# Altium project RADAR.PrjPcb
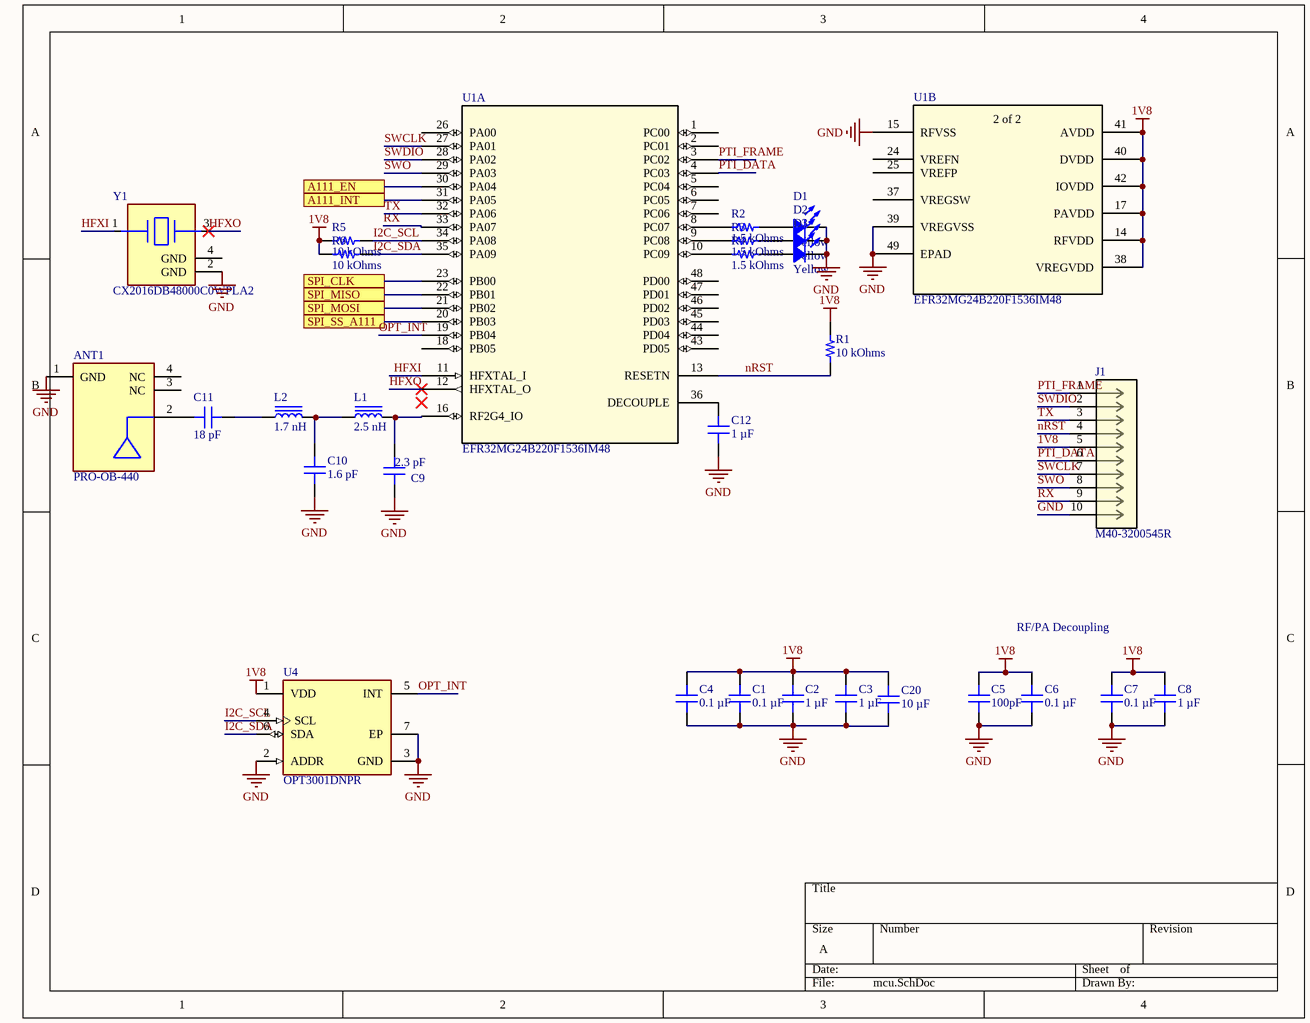
[diagram p0: mcu.SchDoc]
3 sheets, 44 parts. Net scope: flat (ports and power ports of the same name join across sheets).
Board file: PCB.PcbDoc
Sheets:
  mcu.SchDoc
  radar.SchDoc
  power.SchDoc

## Sheet mcu.SchDoc
size A; SheetNumber: 1; SheetTotal: 3

### Parts
(Parts that share a designator on the sheet are numbered #1, #2 ... from top to bottom, then left to right.)
ANT1  PRO-OB-440  [FP-PRO-OB-440-MFG]
C1  0.1 µF  [CAP 0402_1005]
C2  1 µF  [CAP 0402_1005]
C3  1 µF  [CAP 0402_1005]
C4  0.1 µF  [CAP 0402_1005]
C5  100pF  [CAP 0402_1005]
C6  0.1 µF  [CAP 0402_1005]
C7  0.1 µF  [CAP 0402_1005]
C8  1 µF  [CAP 0402_1005]
C9  2.3 pF  [CAP 0402_1005 RF]
C10  1.6 pF  [CAP 0402_1005 RF]
C11  18 pF  [CAP 0402_1005 RF]
C12  1 µF  [CAP 0402_1005]
C20  10 µF  [CAP 0603_1608]
D1  Yellow  [LED 0402_1005 YELLOW]
D2  Yellow  [LED 0402_1005 YELLOW]
D3  Yellow  [LED 0402_1005 YELLOW]
J1  M40-3200545R  [CONN10_M40-3200545R_HRW]
L1  2.5 nH  [IND 0402_1005 RF WW]
L2  1.7 nH  [IND 0402_1005 RF WW]
R1  10 kOhms  [RES 0402_1005]
R2  1.5 kOhms  [RES 0402_1005]
R3  1.5 kOhms  [RES 0402_1005]
R4  1.5 kOhms  [RES 0402_1005]
R5  10 kOhms  [RES 0402_1005]
R6  10 kOhms  [RES 0402_1005]
U1  EFR32MG24B220F1536IM48  [QFN48_0p4_6sq_SIL]  (parts A,B of 2)
U4#1  OPT3001DNPR  [FP-DNP0006A-MFG]
Y1  CX2016DB48000C0WPLA2  [FP-CX2016DB48000C0WPLA2-MFG]

### Ports
A111_EN, A111_INT, SPI_CLK, SPI_MISO, SPI_MOSI, SPI_SS_A111

### Nets
1V8: C1.2 C2.2 C3.2 C4.2 C5.2 C6.2 C7.2 C8.2 C20.2 J1.5 R1.1 R5.2 R6.2 U1.14(RFVDD) U1.17(PAVDD) U1.38(VREGVDD) U1.40(DVDD) U1.41(AVDD) U1.42(IOVDD) U4#1.1(VDD)
GND: ANT1.1(GND) C1.1 C2.1 C3.1 C4.1 C5.1 C6.1 C7.1 C8.1 C9.1 C10.1 C12.1 C20.1 D1.2 D2.2 D3.2 J1.10 U1.15(RFVSS) U1.39(VREGVSS) U1.49(EPAD) U4#1.2(ADDR) U4#1.3(GND) U4#1.7(EP) Y1.2(GND)
HFXI: U1.11(HFXTAL_I) Y1.1(1_HOT)
HFXO: U1.12(HFXTAL_O) Y1.3(2_HOT)
I2C_SCL: R5.1 U1.34(PA08) U4#1.4(SCL)
I2C_SDA: R6.1 U1.35(PA09) U4#1.6(SDA)
nRST: J1.4 R1.2 U1.13(RESETN)
OPT_INT: U1.19(PB04) U4#1.5(INT)
PTI_DATA: J1.6 U1.4(PC03)
PTI_FRAME: J1.1 U1.3(PC02)
RX: J1.9 U1.33(PA07)
SWCLK: J1.7 U1.27(PA01)
SWDIO: J1.2 U1.28(PA02)
SWO: J1.8 U1.29(PA03)
TX: J1.3 U1.32(PA06)
NetANT1_2: ANT1.2(RF_FEED) C11.1
NetC9_2: C9.2 L1.2 U1.16(RF2G4_IO)
NetC10_2: C10.2 L1.1 L2.2
NetC11_2: C11.2 L2.1
NetC12_2: C12.2 U1.36(DECOUPLE)
NetD1_1: D1.1 R2.1
NetD2_1: D2.1 R3.1
NetD3_1: D3.1 R4.1
NetR2_2: R2.2 U1.8(PC07)
NetR3_2: R3.2 U1.9(PC08)
NetR4_2: R4.2 U1.10(PC09)
NetU1_20: U1.20(PB03) ; port SPI_SS_A111
NetU1_21: U1.21(PB02) ; port SPI_MOSI
NetU1_22: U1.22(PB01) ; port SPI_MISO
NetU1_23: U1.23(PB00) ; port SPI_CLK
NetU1_30: U1.30(PA04) ; port A111_EN
NetU1_31: U1.31(PA05) ; port A111_INT

Not connected (* = marked no-connect by the designer): ANT1 3(NC) 4(NC); U1 1(PC00) 2(PC01) 5(PC04) 6(PC05) 7(PC06) 18(PB05) 24(VREFN) 25(VREFP) 26(PA00) 37(VREGSW) 43(PD05) 44(PD04) 45(PD03) 46(PD02) 47(PD01) 48(PD00); Y1 4(GND)

### Notes on the sheet
- RF/PA Decoupling
- (in symbol EFR32MG24B220F1536IM48, part B) 2 of 2

### Library data of the parts
ANT1 = CMP-231248-000001-1: RF ANT 2.4GHZ STAMPED MET SLD; Manufacturer: ProAnt; Return Loss: -10dB; Impedance: 50Ω; Max Frequency: 2500MHz; Number Of Bands: 1; Bandwidth: 2400-2500MHz; Temperature Range Low: -40°C; Height: 3.53mm; ComponentLink2URL: http://www.proant.se/files/user/Documents/Datasheets%20and%20appnotes/Upload%202018-06-08/Application%20note%20-%20OnBoard%20SMD%202400%20MHz%20rev%203.2.pdf; Octopart: https://octopart.com/pro-ob-440-proant+ab-62921801; Digikey Description: RF ANT 2.4GHZ STAMPED MET SLD; Device Class L1: Integrated Circuits (ICs); ComponentLink2Description: Datasheet; Package: PRO-OB-440; Temperature: -40°C to +125°C; Category: Ant; Lead Free: Yes; Device Class L3: RF Antennas; RoHS: TRUE; Automotive: No; Device Class L2: RF Semiconductors and Devices; Manufacturer Part Number: PRO-OB-440; Temperature Range High: +125°C
C1 = C0402C104K4RECAUTO: CAP CER 0402 0.1UF 16V X7R 10%; manufacturer: KEMET; Part Number: C0402C104K4RECAUTO; Value: 0.1 µF; Applications: Automotive, ESD Protection; Capacitance: 0.1 µF; componentlink1description: Datasheet; componentlink1url: https://api.kemet.com/component-edge/download/datasheet/C0402C104K4RECAUTO.pdf; componentlink2description: DigiKey Link; componentlink2url: https://www.digikey.com/en/products/detail/kemet/C0402C104K4RECAUTO/8563695; Device Package: 0402 (1005 Metric); lastupdated: 1/9/2022 12:30:53 pm; Lifecycle Status: Active; Minimum Order: 1; Mounting Type: Surface Mount, MLCC; Operating Temperature: -55°C ~ 125°C; Package / Case: 0402 (1005 Metric); packaging: TapeAndReel; partid: 1731; Part Status: Active; price: 0.01; Ratings: AEC-Q200; series: ESD SMD Auto X7R; Size / Dimension: 0.039" L x 0.020" W (1.00mm x 0.50mm); Supplier 1: DigiKey; Supplier Part Number 1: 399-17167-1-ND; Temperature Coefficient: X7R; Thickness (Max): 0.022" (0.55mm); Tolerance: ±10%; Voltage - Rated: 16V
C2 C3 = LMK105BJ105MVHF: CAP CER 1UF 10V X5R 0402; manufacturer: Taiyo Yuden; Tolerance: ±20%; Part Number: LMK105BJ105MVHF; Value: 1 µF; Applications: Automotive, SMPS Filtering; Capacitance: 1 µF; componentlink1description: Datasheet; componentlink1url: https://ds.yuden.co.jp/TYCOMPAS/ut/detail?pn=LMK105BJ105MVHF &u=M; componentlink2description: DigiKey Link; componentlink2url: https://www.digikey.com/en/products/detail/taiyo-yuden/LMK105BJ105MVHF/7403746; Device Package: 0402 (1005 Metric); lastupdated: 1/9/2022 12:30:35 pm; Lifecycle Status: Active; Minimum Order: 1; Mounting Type: Surface Mount, MLCC; Operating Temperature: -55°C ~ 85°C; Package / Case: 0402 (1005 Metric); packaging: TapeAndReel; partid: 46675; Part Status: Active; price: 0.01; Ratings: AEC-Q200; series: M; Size / Dimension: 0.039" L x 0.020" W (1.00mm x 0.50mm); Supplier 1: DigiKey; Supplier Part Number 1: 587-6276-1-ND; Temperature Coefficient: X5R; Thickness (Max): 0.022" (0.55mm); Voltage - Rated: 10V
C4 C6 C7 C12 = C0402C104K7PAC7867: CAP CER 0.1UF 4V X5R 0402; manufacturer: KEMET; Tolerance: ±10%; Part Number: C0402C104K7PAC7867; Applications: Bypass, Decoupling; componentlink1description: Datasheet; componentlink1url: https://api.kemet.com/component-edge/download/datasheet/C0402C104K7PAC7867.pdf; componentlink2description: DigiKey Link; componentlink2url: https://www.digikey.com/en/products/detail/kemet/C0402C104K7PAC7867/7381987; Device Package: 0402 (1005 Metric); lastupdated: 1/9/2022 12:30:40 pm; Lifecycle Status: Active; Minimum Order: 1; Mounting Type: Surface Mount, MLCC; Operating Temperature: -55°C ~ 85°C; Package / Case: 0402 (1005 Metric); packaging: TapeAndReel; partid: 5603; Part Status: Active; price: 0.01; series: SMD Comm X5R; Size / Dimension: 0.039" L x 0.020" W (1.00mm x 0.50mm); Supplier 1: DigiKey; Supplier Part Number 1: 399-14871-1-ND; Temperature Coefficient: X5R; Thickness (Max): 0.022" (0.55mm); Voltage - Rated: 4V
  C4 C6 C7: Value: 0.1 µF; Capacitance: 0.1 µF
  C12: Value: 1 µF; Capacitance: 1 µF
C5 = 04026C101KAT2A: CAP CER 100PF 6.3V X7R 0402; manufacturer: AVX Corporation; Tolerance: ±10%; Part Number: 04026C101KAT2A; Value: 100pF; Applications: General Purpose; Capacitance: 100pF; componentlink1description: Datasheet; componentlink1url: http://datasheets.avx.com/X7RDielectric.pdf; componentlink2description: DigiKey Link; componentlink2url: http://digikey.com/product-detail/en/avx-corporation/04026C101KAT2A/478-12647-1-ND/9949180; Device Package: 0402 (1005 Metric); lastupdated: 8/2/2022 12:26:54 pm; Lifecycle Status: Active; Minimum Order: 1; Mounting Type: Surface Mount, MLCC; Operating Temperature: -55°C ~ 125°C; Package / Case: 0402 (1005 Metric); packaging: TapeAndReel; partid: 4266; Part Status: Active; price: 0.04; series: -; Size / Dimension: 0.039" L x 0.020" W (1.00mm x 0.50mm); Supplier 1: DigiKey; Supplier Part Number 1: 478-12647-1-ND; Temperature Coefficient: X7R; Thickness (Max): 0.022" (0.56mm); Voltage - Rated: 6.3V
C8 = CGB2T1X5R0G105M022BC: CAP CER 1UF 4V X5R 0402; manufacturer: TDK Corporation; Tolerance: ±20%; Part Number: CGB2T1X5R0G105M022BC; Value: 1 µF; Applications: General Purpose; Capacitance: 1 µF; componentlink1description: Datasheet; componentlink1url: https://product.tdk.com/info/en/catalog/datasheets/mlcc_commercial_lowprofile_en.pdf?ref_disty=digikey; componentlink2description: DigiKey Link; componentlink2url: https://www.digikey.com/en/products/detail/tdk-corporation/CGB2T1X5R0G105M022BC/4278344; Device Package: 0402 (1005 Metric); Features: Low Profile; lastupdated: 1/9/2022 12:30:48 pm; Lifecycle Status: Active; Minimum Order: 1; Mounting Type: Surface Mount, MLCC; Operating Temperature: -55°C ~ 85°C; Package / Case: 0402 (1005 Metric); packaging: TapeAndReel; partid: 2563; Part Status: Active; price: 0.08; series: CGB; Size / Dimension: 0.039" L x 0.020" W (1.00mm x 0.50mm); Supplier 1: DigiKey; Supplier Part Number 1: 445-15611-1-ND; Temperature Coefficient: X5R; Thickness (Max): 0.009" (0.22mm); Voltage - Rated: 4V
C9 = GJM1555C1H2R3BB01D: CAP CER 2.3PF 50V C0G/NP0 0402; manufacturer: Murata Electronics; Temperature Coefficient: C0G, NP0; Tolerance: ±0.1pF; Part Number: GJM1555C1H2R3BB01D; Applications: RF, Microwave, High Frequency; Capacitance: 2.3 pF; componentlink1description: Datasheet; componentlink1url: https://search.murata.co.jp/Ceramy/image/img/A01X/G101/ENG/GJM1555C1H2R3BB01-01.pdf; componentlink2description: DigiKey Link; componentlink2url: https://www.digikey.com/en/products/detail/murata-electronics/GJM1555C1H2R3BB01D/2592923; Device Package: 0402 (1005 Metric); Features: High Q, Low Loss; lastupdated: 1/9/2022 1:07:39 pm; Lifecycle Status: Active; Minimum Order: 1; Mounting Type: Surface Mount, MLCC; Operating Temperature: -55°C ~ 125°C; Package / Case: 0402 (1005 Metric); packaging: TapeAndReel; partid: 2854; Part Status: Active; price: 0.02; series: GJM; Size / Dimension: 0.039" L x 0.020" W (1.00mm x 0.50mm); Supplier 1: DigiKey; Supplier Part Number 1: 490-GJM1555C1H2R3BB01DCT-ND; Thickness (Max): 0.022" (0.55mm); value: 2.3 pF; Voltage - Rated: 50V
C10 = GJM1555C1H1R6CB01D: CAP CER 1.6PF 50V C0G/NP0 0402; manufacturer: Murata Electronics; Temperature Coefficient: C0G, NP0; Tolerance: ±0.25pF; Part Number: GJM1555C1H1R6CB01D; Applications: RF, Microwave, High Frequency; Capacitance: 1.6 pF; componentlink1description: Datasheet; componentlink1url: https://search.murata.co.jp/Ceramy/image/img/A01X/G101/ENG/GJM1555C1H1R6CB01-01.pdf; componentlink2description: DigiKey Link; componentlink2url: https://www.digikey.com/en/products/detail/murata-electronics/GJM1555C1H1R6CB01D/702281; Device Package: 0402 (1005 Metric); Features: High Q, Low Loss; lastupdated: 1/9/2022 1:07:42 pm; Lifecycle Status: Active; Minimum Order: 1; Mounting Type: Surface Mount, MLCC; Operating Temperature: -55°C ~ 125°C; Package / Case: 0402 (1005 Metric); packaging: TapeAndReel; partid: 624; Part Status: Active; price: 0.01; series: GJM; Size / Dimension: 0.039" L x 0.020" W (1.00mm x 0.50mm); Supplier 1: DigiKey; Supplier Part Number 1: 490-3088-1-ND; Thickness (Max): 0.022" (0.55mm); value: 1.6 pF; Voltage - Rated: 50V
C11 = 600L180FW200T: CAP CER 18PF 200V NP0 0402; manufacturer: American Technical Ceramics; Temperature Coefficient: C0G, NP0; Tolerance: ±1%; Part Number: 600L180FW200T; Applications: RF, Microwave, High Frequency, Bypass, Decoupling; Capacitance: 18 pF; componentlink1description: Datasheet; componentlink1url: http://www.atceramics.com/UserFiles/600l.pdf; componentlink2description: DigiKey Link; componentlink2url: https://www.digikey.com/en/products/detail/american-technical-ceramics/600L180FW200T/3908918; Device Package: 0402 (1005 Metric); Features: High Q, Low Loss, Ultra Low ESR; lastupdated: 1/9/2022 1:07:41 pm; Lifecycle Status: Active; Minimum Order: 1; Mounting Type: Surface Mount, MLCC; Operating Temperature: -55°C ~ 125°C; Package / Case: 0402 (1005 Metric); packaging: TapeAndReel; partid: 1343; Part Status: Active; price: 0.49; series: ATC 600L; Size / Dimension: 0.040" L x 0.020" W (1.02mm x 0.51mm); Supplier 1: DigiKey; Supplier Part Number 1: 478-12298-1-ND; Thickness (Max): 0.024" (0.60mm); value: 18 pF; Voltage - Rated: 200V
C20 = GRM188R60J106ME47D: CAP CER 10UF 6.3V X5R 0603; manufacturer: Murata Electronics; Tolerance: ±20%; Part Number: GRM188R60J106ME47D; Value: 10 µF; Applications: General Purpose; Capacitance: 10 µF; componentlink1description: Datasheet; componentlink1url: https://www.murata.com/~/media/webrenewal/support/library/catalog/products/capacitor/mlcc/c02e.ashx?la=en-us; componentlink2description: DigiKey Link; componentlink2url: https://www.digikey.com/en/products/detail/murata-electronics/GRM188R60J106ME47D/965910; Device Package: 0603 (1608 Metric); lastupdated: 11/9/2022 9:40:24 am; Lifecycle Status: Active; Minimum Order: 1; Mounting Type: Surface Mount, MLCC; Operating Temperature: -55°C ~ 85°C; Package / Case: 0603 (1608 Metric); packaging: TapeAndReel; partid: 2351; Part Status: Active; price: 0.02; series: GRM; Size / Dimension: 0.063" L x 0.031" W (1.60mm x 0.80mm); Supplier 1: DigiKey; Supplier Part Number 1: 490-3896-1-ND; Temperature Coefficient: X5R; Thickness (Max): 0.035" (0.90mm); Voltage - Rated: 6.3V
D1-D3 = BL-HKC37A-AV-TRB: 0402 YELLOW; Manufacturer: American Bright Optoelectronics Corporation; Configuration: Standard; Current - Test: 20mA; Lens Color: Colorless; Lens Style: Rectangle with Flat Top; Lens Transparency: Clear; Millicandela Rating: 120mcd; Viewing Angle: 120°; Voltage - Forward (Vf) (Typ): 2.2V; Wavelength - Dominant: 589nm; Wavelength - Peak: 590nm; Part Number: BL-HKC37A-AV-TRB; Color: Yellow; ComponentLink1Description: Datasheet; ComponentLink1URL: https://americanbrightled.com/pdffiles/smt/BL-HKC37A-AV-TRB.pdf; ComponentLink2Description: DigiKey Link; ComponentLink2URL: https://www.digikey.com/en/products/detail/american-bright-optoelectronics-corporation/BL-HKC37A-AV-TRB/9678171; Device Package: 0402 (1005 Metric); Height (Max): 0.45mm; LastUpdated: 11/9/2022 10:29:51 am; Lifecycle Status: Active; Minimum Order: 1; Mounting Type: Surface Mount; Package / Case: 0402 (1005 Metric); Packaging: TapeAndReel; PartId: 1041; Part Status: Active; Price: 0.06; Series: -; Size / Dimension: 1.00mm L x 0.50mm W; Supplier 1: DigiKey; Supplier Part Number 1: BL-HKC37A-AV-TRBCT-ND; Supplier Device Package: 0402; Value: Yellow
J1 = M40-3200545R: No Description Available; Mfr_Name: Harwin; Copyright: Copyright (C) 2022 Ultra Librarian. All rights reserved.; Manufacturer_Part_Number: M40-3200545R; RefDes: RefDes; Type: DEV
L1 = LQW15AN2N5B00D: FIXED IND 2.5NH 850MA 50MOHM SMD; Manufacturer: Murata Electronics; DC Resistance (DCR): 50mOhm Max; Frequency - Self Resonant: 15GHz; Inductance Frequency - Test: 100 MHz; Material - Core: Non-Magnetic; Q @ Freq: 20 @ 250MHz; Shielding: Unshielded; Tolerance: ±0.1nH; Type: Wirewound; Part Number: LQW15AN2N5B00D; ComponentLink1Description: Datasheet; ComponentLink1URL: https://search.murata.co.jp/Ceramy/image/img/P02/JELF243A-0050.pdf; ComponentLink2Description: DigiKey Link; ComponentLink2URL: https://www.digikey.com/en/products/detail/murata-electronics/LQW15AN2N5B00D/2594886; Current Rating (Amps): 850 mA; Device Package: 0402 (1005 Metric); Height - Seated (Max): 0.024" (0.60mm); Inductance: 2.5 nH; LastUpdated: 1/9/2022 1:17:31 pm; Lifecycle Status: Active; Minimum Order: 1; Mounting Type: Surface Mount; Operating Temperature: -55°C ~ 125°C; Package / Case: 0402 (1005 Metric); Packaging: TapeAndReel; PartId: 337; Part Status: Active; Price: 0.05; Series: LQW15; Size / Dimension: 0.039" L x 0.024" W (1.00mm x 0.60mm); Supplier 1: DigiKey; Supplier Part Number 1: 490-8437-1-ND; Value: 2.5 nH
L2 = LQW15AN1N7D8ZD: FIXED IND 1.7NH 1.15A 65MOHM SMD; Manufacturer: Murata Electronics; DC Resistance (DCR): 65mOhm Max; Frequency - Self Resonant: 18GHz; Inductance Frequency - Test: 100 MHz; Material - Core: Non-Magnetic; Q @ Freq: 20 @ 250MHz; Shielding: Unshielded; Tolerance: ±0.5nH; Type: Wirewound; Part Number: LQW15AN1N7D8ZD; ComponentLink1Description: Datasheet; ComponentLink1URL: https://search.murata.co.jp/Ceramy/image/img/P02/JELF243A-9138.pdf; ComponentLink2Description: DigiKey Link; ComponentLink2URL: https://www.digikey.com/en/products/detail/murata-electronics/LQW15AN1N7D8ZD/6798783; Current Rating (Amps): 1.15 A; Device Package: 0402 (1005 Metric); Height - Seated (Max): 0.024" (0.60mm); Inductance: 1.7 nH; LastUpdated: 1/9/2022 1:17:33 pm; Lifecycle Status: Active; Minimum Order: 1; Mounting Type: Surface Mount; Operating Temperature: -55°C ~ 125°C; Package / Case: 0402 (1005 Metric); Packaging: TapeAndReel; PartId: 80; Part Status: Active; Price: 0.07; Ratings: AEC-Q200; Series: LQW15; Size / Dimension: 0.039" L x 0.024" W (1.00mm x 0.60mm); Supplier 1: DigiKey; Supplier Part Number 1: 490-15358-1-ND; Supplier Device Package: 0402 (1005 Metric); Value: 1.7 nH
R1 R5 R6 = RP73PF1E10KBTD: RES 10K OHM 0.1% 1/10W 0402; Manufacturer: TE Connectivity Passive Product; Power (Watts): 0.1W, 1/10W; Temperature Coefficient: ±25ppm/°C; Part Number: RP73PF1E10KBTD; Value: 10 kOhms; ComponentLink1Description: Datasheet; ComponentLink1URL: https://www.te.com/commerce/DocumentDelivery/DDEController?Action=srchrtrv&DocNm=1773272&DocType=DS&DocLang=English; ComponentLink2Description: DigiKey Link; ComponentLink2URL: https://www.digikey.com/en/products/detail/te-connectivity-passive-product/RP73PF1E10KBTD/8260957; Composition: Thin Film; Device Package: 0402 (1005 Metric); Height - Seated (Max): 0.014" (0.35mm); LastUpdated: 1/9/2022 12:46:57 pm; Lifecycle Status: Active; Minimum Order: 1; Number of Terminations: 2; Operating Temperature: -55°C ~ 155°C; Package / Case: 0402 (1005 Metric); Packaging: TapeAndReel; PartId: 2434; Part Status: Active; Price: 0.09; Resistance: 10 kOhms; Series: RP73, Holsworthy; Size / Dimension: 0.039" L x 0.020" W (1.00mm x 0.50mm); Supplier 1: DigiKey; Supplier Part Number 1: A127415CT-ND; Supplier Device Package: 0402; Tolerance: ±0.1%
R2-R4 = ERA-2VRW1501X: RES 1.5K OHM 0.05% 1/10W 0402; Manufacturer: Panasonic Electronic Components; Power (Watts): 0.1W, 1/10W; Temperature Coefficient: ±10ppm/°C; Part Number: ERA-2VRW1501X; Value: 1.5 kOhms; ComponentLink1Description: Datasheet; ComponentLink1URL: https://api.pim.na.industrial.panasonic.com/file_stream/main/fileversion/9152; ComponentLink2Description: DigiKey Link; ComponentLink2URL: https://www.digikey.com/en/products/detail/panasonic-electronic-components/ERA-2VRW1501X/12086957; Composition: Thin Film; Device Package: 0402 (1005 Metric); Features: Anti-Sulfur, Automotive AEC-Q200; Height - Seated (Max): 0.016" (0.40mm); LastUpdated: 11/9/2022 9:53:08 am; Lifecycle Status: Active; Minimum Order: 1; Number of Terminations: 2; Operating Temperature: -55°C ~ 155°C; Package / Case: 0402 (1005 Metric); Packaging: TapeAndReel; PartId: 67400; Part Status: Active; Price: 0.24; Ratings: AEC-Q200; Resistance: 1.5 kOhms; Series: ERA-2V; Size / Dimension: 0.039" L x 0.020" W (1.00mm x 0.50mm); Supplier 1: DigiKey; Supplier Part Number 1: 10-ERA-2VRW1501XCT-ND; Supplier Device Package: 0402; Tolerance: ±0.05%
U1 = EFR32MG24B220F1536IM48: No Description Available; Mfr_Name: Silicon Labs; Copyright: Copyright (C) 2022 Ultra Librarian. All rights reserved.; Manufacturer_Part_Number: EFR32MG24B220F1536IM48; RefDes: RefDes; Type: DEV
U4#1 = CMP-04942-000002-1: SENSOR OPT 550NM AMBIENT 6USON; Manufacturer: Texas Instruments; Max Junction Temp: +150°C; Description: Optical Sensor Ambient 550nm I²C 6-UDFN Exposed Pad; Operating Supply Current: 0.3-1.8uA; Sensor Output: I2C,SMBus; Max Supply Voltage: 3.6V; Min Supply Voltage: 1.6V; Standoff Height: 0mm; Package: DNP0006A; Device Class L2: Optical Sensors; Temperature Range Low: -40°C; Digikey Description: SENSOR OPT 550NM AMBIENT 6USON; Automotive: No; Category: IC; Manufacturer Part Number: OPT3001DNPR; RoHS: TRUE; ComponentLink2URL: http://www.ti.com/lit/ds/symlink/opt3001.pdf; Lead Free: Yes; Octopart: https://octopart.com/opt3001dnpr-texas+instruments-47324050; Device Class L3: unset; ComponentLink2Description: Datasheet; Device Class L1: Sensors; Temperature Range High: +85°C; Temperature: -40°C to +85°C; Height: 0.65mm; Ipc Land Pattern Name: DFN200X200X60-6
Y1 = CMP-20727-000003-1: CRYSTAL 48.0000MHZ 7PF SMD; Manufacturer: Kyocera; Tolerance: 20ppm; Esr: 22Ω; Frequency: 48000kHz; Height: 0.45mm; Load Capacitance: 7pF; Temperature: -40°C to +85°C; Automotive: No; Temperature Range High: +85°C; Octopart: https://octopart.com/cx2016db48000c0wpla2-avx+%2F+kyocera-52876167; Device Class L2: Crystals / Oscillators; Lead Free: Yes; Digikey Description: CRYSTAL 48.0000MHZ 7PF SMD; Mouser Description: Crystals 48MHz 7pF; Device Class L1: Passive Components; RoHS: TRUE; Temperature Range Low: -40°C; Package: 0; ComponentLink2Description: Datasheet; Device Class L3: Crystals; Series: CX2016DB; Category: Crys; ComponentLink2URL: https://global.kyocera.com/prdct/electro/product/pdf/cx2016db_e.pdf; Manufacturer Part Number: CX2016DB48000C0WPLA2

## Sheet radar.SchDoc
size A4; SheetNumber: 2; SheetTotal: 3
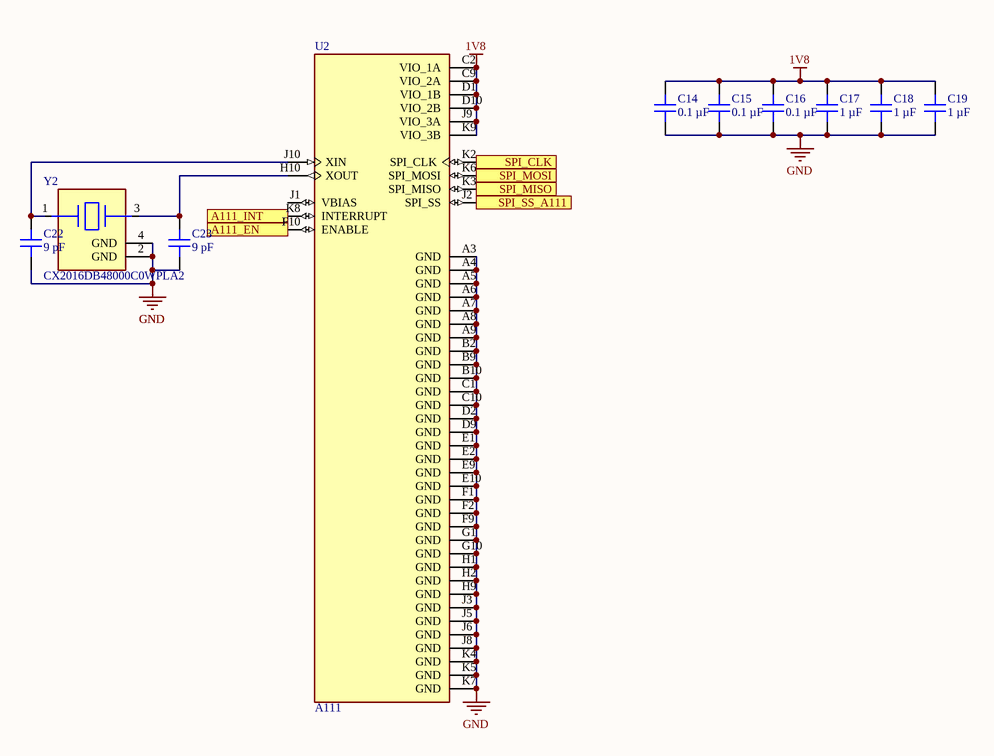
[diagram p1: radar.SchDoc]

### Parts
(Parts that share a designator on the sheet are numbered #1, #2 ... from top to bottom, then left to right.)
C14  0.1 µF  [CAP 0402_1005]
C15  0.1 µF  [CAP 0402_1005]
C16  0.1 µF  [CAP 0402_1005]
C17  1 µF  [CAP 0402_1005]
C18  1 µF  [CAP 0402_1005]
C19  1 µF  [CAP 0402_1005]
C22  9 pF  [CAP 0402_1005]
C23#1  9 pF  [CAP 0402_1005]
U2  A111  [BGA50N50P10X10_520X550X89N]
Y2  CX2016DB48000C0WPLA2  [FP-CX2016DB48000C0WPLA2-MFG]

### Ports
A111_EN, A111_INT, SPI_CLK, SPI_MISO, SPI_MOSI, SPI_SS_A111

### Nets
1V8: C14.2 C15.2 C16.2 C17.2 C18.2 C19.2 U2.C2(VIO_1A) U2.C9(VIO_2A) U2.D1(VIO_1B) U2.D10(VIO_2B) U2.J9(VIO_3A) U2.K9(VIO_3B)
GND: C14.1 C15.1 C16.1 C17.1 C18.1 C19.1 C22.1 C23#1.1 U2.A3(GND) U2.A4(GND) U2.A5(GND) U2.A6(GND) U2.A7(GND) U2.A8(GND) U2.A9(GND) U2.B2(GND) U2.B9(GND) U2.B10(GND) U2.C1(GND) U2.C10(GND) U2.D2(GND) U2.D9(GND) U2.E1(GND) U2.E2(GND) U2.E9(GND) U2.E10(GND) U2.F1(GND) U2.F2(GND) U2.F9(GND) U2.G1(GND) U2.G10(GND) U2.H1(GND) U2.H2(GND) U2.H9(GND) U2.J3(GND) U2.J5(GND) U2.J6(GND) U2.J8(GND) U2.K4(GND) U2.K5(GND) U2.K7(GND) Y2.2(GND) Y2.4(GND)
NetC22_2: C22.2 U2.J10(XIN) Y2.1(1_HOT)
NetC23#1_2: C23#1.2 U2.H10(XOUT) Y2.3(2_HOT)
NetU1_20: U2.J2(SPI_SS) ; port SPI_SS_A111
NetU1_21: U2.K6(SPI_MOSI) ; port SPI_MOSI
NetU1_22: U2.K3(SPI_MISO) ; port SPI_MISO
NetU1_23: U2.K2(SPI_CLK) ; port SPI_CLK
NetU1_30: U2.F10(ENABLE) ; port A111_EN
NetU1_31: U2.K8(INTERRUPT) ; port A111_INT

Not connected (* = marked no-connect by the designer): U2 J1(VBIAS)

### Library data of the parts
C14-C16 = C0402C104K7PAC7867: as C4 on sheet mcu; Part Number: C0402C104K7PAC7867; Value: 0.1 µF; Applications: Bypass, Decoupling; Capacitance: 0.1 µF; componentlink1description: Datasheet; componentlink1url: https://api.kemet.com/component-edge/download/datasheet/C0402C104K7PAC7867.pdf; componentlink2description: DigiKey Link; componentlink2url: https://www.digikey.com/en/products/detail/kemet/C0402C104K7PAC7867/7381987; Device Package: 0402 (1005 Metric); lastupdated: 11/9/2022 9:36:31 am; Lifecycle Status: Active; Minimum Order: 1; Mounting Type: Surface Mount, MLCC; Operating Temperature: -55°C ~ 85°C; Package / Case: 0402 (1005 Metric); packaging: TapeAndReel; partid: 5603; Part Status: Active; price: 0.01; series: SMD Comm X5R; Size / Dimension: 0.039" L x 0.020" W (1.00mm x 0.50mm); Supplier 1: DigiKey; Supplier Part Number 1: 399-14871-1-ND; Temperature Coefficient: X5R; Thickness (Max): 0.022" (0.55mm); Voltage - Rated: 4V
C17-C19 = LMK105C6105KV-F: CAP CER 1UF 10V X6S 0402; manufacturer: Taiyo Yuden; Tolerance: ±10%; Part Number: LMK105C6105KV-F; Value: 1 µF; Applications: SMPS Filtering; Capacitance: 1 µF; componentlink1description: Datasheet; componentlink1url: https://www.yuden.co.jp/productdata/catalog/mlcc01_e.pdf; componentlink2description: DigiKey Link; componentlink2url: https://www.digikey.com/en/products/detail/taiyo-yuden/LMK105C6105KV-F/4157226; Device Package: 0402 (1005 Metric); lastupdated: 11/9/2022 9:36:40 am; Lifecycle Status: Active; Minimum Order: 1; Mounting Type: Surface Mount, MLCC; Operating Temperature: -55°C ~ 105°C; Package / Case: 0402 (1005 Metric); packaging: TapeAndReel; partid: 2215; Part Status: Active; price: 0.01; series: M; Size / Dimension: 0.039" L x 0.020" W (1.00mm x 0.50mm); Supplier 1: DigiKey; Supplier Part Number 1: 587-3409-1-ND; Temperature Coefficient: X6S; Thickness (Max): 0.022" (0.55mm); Voltage - Rated: 10V
C22 C23#1 = CGA2B2C0G1H090D050BA: CAP CER 9PF 50V C0G 0402; manufacturer: TDK Corporation; Temperature Coefficient: C0G, NP0; Tolerance: ±0.5pF; Part Number: CGA2B2C0G1H090D050BA; Value: 9 pF; Applications: Automotive; Capacitance: 9 pF; componentlink1description: Datasheet; componentlink1url: https://product.tdk.com/info/en/catalog/datasheets/mlcc_automotive_general_en.pdf?ref_disty=digikey; componentlink2description: DigiKey Link; componentlink2url: https://www.digikey.com/en/products/detail/tdk-corporation/CGA2B2C0G1H090D050BA/2443061; Device Package: 0402 (1005 Metric); lastupdated: 14/9/2022 7:45:59 am; Lifecycle Status: Active; Minimum Order: 1; Mounting Type: Surface Mount, MLCC; Operating Temperature: -55°C ~ 125°C; Package / Case: 0402 (1005 Metric); packaging: TapeAndReel; partid: 7122; Part Status: Active; price: 0.01; Ratings: AEC-Q200; series: CGA; Size / Dimension: 0.039" L x 0.020" W (1.00mm x 0.50mm); Supplier 1: DigiKey; Supplier Part Number 1: 445-5583-1-ND; Thickness (Max): 0.022" (0.55mm); Voltage - Rated: 50V
U2 = A111: A111 Radar Sensor; MF: acconeer; SnapEDA_Link: https://www.snapeda.com/parts/A111/acconeer/view-part/2777907/?ref=snap; Price: None; MP: A111; Value: *; Availability: Unavailable; Package: SMD-50 acconeer
Y2 = CMP-20727-000003-1: as Y1 on sheet mcu; Height: 0.45mm; Load Capacitance: 7pF; Temperature: -40°C to +85°C; Automotive: No; Temperature Range High: +85°C; Octopart: https://octopart.com/cx2016db48000c0wpla2-avx+%2F+kyocera-52876167; Device Class L2: Crystals / Oscillators; Lead Free: Yes; Digikey Description: CRYSTAL 48.0000MHZ 7PF SMD; Mouser Description: Crystals 48MHz 7pF; Device Class L1: Passive Components; RoHS: TRUE; Temperature Range Low: -40°C; Package: 0; ComponentLink2Description: Datasheet; Device Class L3: Crystals; Series: CX2016DB; Category: Crys; ComponentLink2URL: https://global.kyocera.com/prdct/electro/product/pdf/cx2016db_e.pdf; Manufacturer Part Number: CX2016DB48000C0WPLA2

## Sheet power.SchDoc
size A4; SheetNumber: 3; SheetTotal: 3
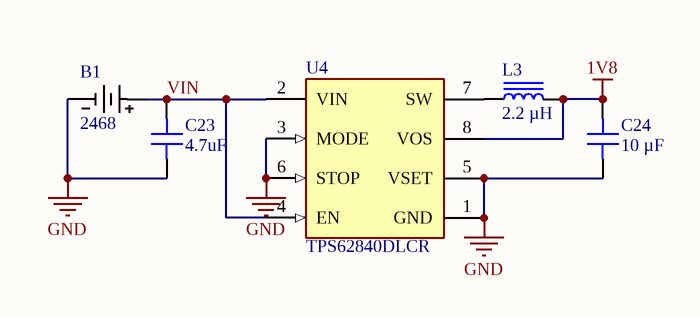
[diagram p2: power.SchDoc]

### Parts
(Parts that share a designator on the sheet are numbered #1, #2 ... from top to bottom, then left to right.)
B1  2468  [2468_KEY]
C23#2  4.7uF  [CAP 0603_1608]
C24  10 µF  [CAP 0603_1608]
L3  2.2 µH  [TDK VLS201612CX]
U4#2  TPS62840DLCR  [FP-DLC0008B-MFG]

### Nets
1V8: C24.2 L3.2 U4#2.8(VOS)
GND: B1.2 C23#2.1 C24.1 U4#2.1(GND) U4#2.3(MODE) U4#2.5(VSET) U4#2.6(STOP)
VIN: B1.1 C23#2.2 U4#2.2(VIN) U4#2.4(EN)
NetL3_1: L3.1 U4#2.7(SW)

### Library data of the parts
B1 = 2468: No Description Available; Mfr_Name: Keystone Electronics; Copyright: Copyright (C) 2022 Ultra Librarian. All rights reserved.; Manufacturer_Part_Number: 2468; RefDes: RefDes; Type: DEV
C23#2 = GRM188R60J106ME47D: CAP CER 10UF 6.3V X5R 0603; manufacturer: Murata Electronics; Capacitance: 10 µF; Tolerance: ±20%; Part Number: GRM188R60J106ME47D; Value: 4.7uF; Applications: General Purpose; componentlink1description: Datasheet; componentlink1url: https://www.murata.com/~/media/webrenewal/support/library/catalog/products/capacitor/mlcc/c02e.ashx?la=en-us; componentlink2description: DigiKey Link; componentlink2url: https://www.digikey.com/en/products/detail/murata-electronics/GRM188R60J106ME47D/965910; Device Package: 0603 (1608 Metric); lastupdated: 11/9/2022 9:40:24 am; Lifecycle Status: Active; Minimum Order: 1; Mounting Type: Surface Mount, MLCC; Operating Temperature: -55°C ~ 85°C; Package / Case: 0603 (1608 Metric); packaging: TapeAndReel; partid: 2351; Part Status: Active; price: 0.02; series: GRM; Size / Dimension: 0.063" L x 0.031" W (1.60mm x 0.80mm); Supplier 1: DigiKey; Supplier Part Number 1: 490-3896-1-ND; Temperature Coefficient: X5R; Thickness (Max): 0.035" (0.90mm); Voltage - Rated: 6.3V
C24 = GRM188R60J106ME47D: as C20 on sheet mcu; Part Number: GRM188R60J106ME47D; Value: 10 µF; Applications: General Purpose; Capacitance: 10 µF; componentlink1description: Datasheet; componentlink1url: https://www.murata.com/~/media/webrenewal/support/library/catalog/products/capacitor/mlcc/c02e.ashx?la=en-us; componentlink2description: DigiKey Link; componentlink2url: https://www.digikey.com/en/products/detail/murata-electronics/GRM188R60J106ME47D/965910; Device Package: 0603 (1608 Metric); lastupdated: 11/9/2022 9:40:24 am; Lifecycle Status: Active; Minimum Order: 1; Mounting Type: Surface Mount, MLCC; Operating Temperature: -55°C ~ 85°C; Package / Case: 0603 (1608 Metric); packaging: TapeAndReel; partid: 2351; Part Status: Active; price: 0.02; series: GRM; Size / Dimension: 0.063" L x 0.031" W (1.60mm x 0.80mm); Supplier 1: DigiKey; Supplier Part Number 1: 490-3896-1-ND; Temperature Coefficient: X5R; Thickness (Max): 0.035" (0.90mm); Voltage - Rated: 6.3V
L3 = VLS201612CX-6R8M-1: FIXED IND 6.8UH 930MA 368MOHM SM; Manufacturer: TDK Corporation; Current - Saturation: 730mA; DC Resistance (DCR): 368mOhm Max; Inductance: 6.8 µH; Inductance Frequency - Test: 1 MHz; Material - Core: Ferrite; Shielding: Shielded; Tolerance: ±20%; Type: Drum Core, Wirewound; Part Number: VLS201612CX-6R8M-1; ComponentLink1Description: Datasheet; ComponentLink1URL: https://product.tdk.com/info/en/catalog/datasheets/inductor_commercial_power_vls201612cx-1_en.pdf?ref_disty=digikey; ComponentLink2Description: DigiKey Link; ComponentLink2URL: https://www.digikey.com/en/products/detail/tdk-corporation/VLS201612CX-6R8M-1/5169771; Current Rating (Amps): 930 mA; Device Package: Nonstandard; Height - Seated (Max): 0.047" (1.20mm); LastUpdated: 11/9/2022 10:31:03 am; Lifecycle Status: Active; Minimum Order: 1; Mounting Type: Surface Mount; Operating Temperature: -40°C ~ 105°C; Package / Case: Nonstandard; Packaging: TapeAndReel; PartId: 207; Part Status: Active; Price: 0.13; Series: VLS-CX-1; Size / Dimension: 0.079" L x 0.063" W (2.00mm x 1.60mm); Supplier 1: DigiKey; Supplier Part Number 1: 445-172966-1-ND; Supplier Device Package: 2016; Value: 2.2 µH
U4#2 = CMP-04918-000086-1: ULTRA LOW IQ BUCK CONVERTER; Manufacturer: Texas Instruments; Standoff Height: 0mm; Nominal Supply Current: 0.005-3000uA; Switching Frequency: 1.8MHz; Max Duty Cycle: 100%; Min Supply Voltage: 1.8V; Output Current: 750mA; Max Supply Voltage: 6.5V; Max Junction Temp: +125°C; Output Type: AdjustableProgrammable; Output Voltage: 1.8-3.3V; Number Of Outputs: 1; Device Class L1: Integrated Circuits (ICs); Device Class L3: Voltage Regulators - Switching; RoHS: TRUE; Automotive: No; Package: DLC0008B; ComponentLink2URL: http://www.ti.com/lit/ds/symlink/tps62840.pdf; Height: 1mm; Lead Free: Yes; Octopart: https://octopart.com/tps62840dlcr-texas+instruments-103121111; Mouser Description: 60-nA IQ, 1.8-V to 6.5-VIN, high-efficiency 750-mA step-down converter 8-VSON-HR -40 to 125; Manufacturer Part Number: TPS62840DLCR; Ipc Land Pattern Name: DFN200X150X100-8; Temperature: -40°C to +125°C; ComponentLink2Description: Datasheet; Switching Topology: Buck; Temperature Range Low: -40°C; Device Class L2: Power Management ICs; Temperature Range High: +125°C; Digikey Description: ULTRA LOW IQ BUCK CONVERTER; Category: IC

## Nets that join several sheets
1V8: mcu (20 pins), radar (12 pins), power (C24.2 L3.2 U4#2.8)
GND: mcu (24 pins), radar (43 pins), power (7 pins)
NetU1_20: mcu (U1.20), radar (U2.J2)
NetU1_21: mcu (U1.21), radar (U2.K6)
NetU1_22: mcu (U1.22), radar (U2.K3)
NetU1_23: mcu (U1.23), radar (U2.K2)
NetU1_30: mcu (U1.30), radar (U2.F10)
NetU1_31: mcu (U1.31), radar (U2.K8)